# EAGLE design bluz_gw_v1 (EAGLE 7.3.0)
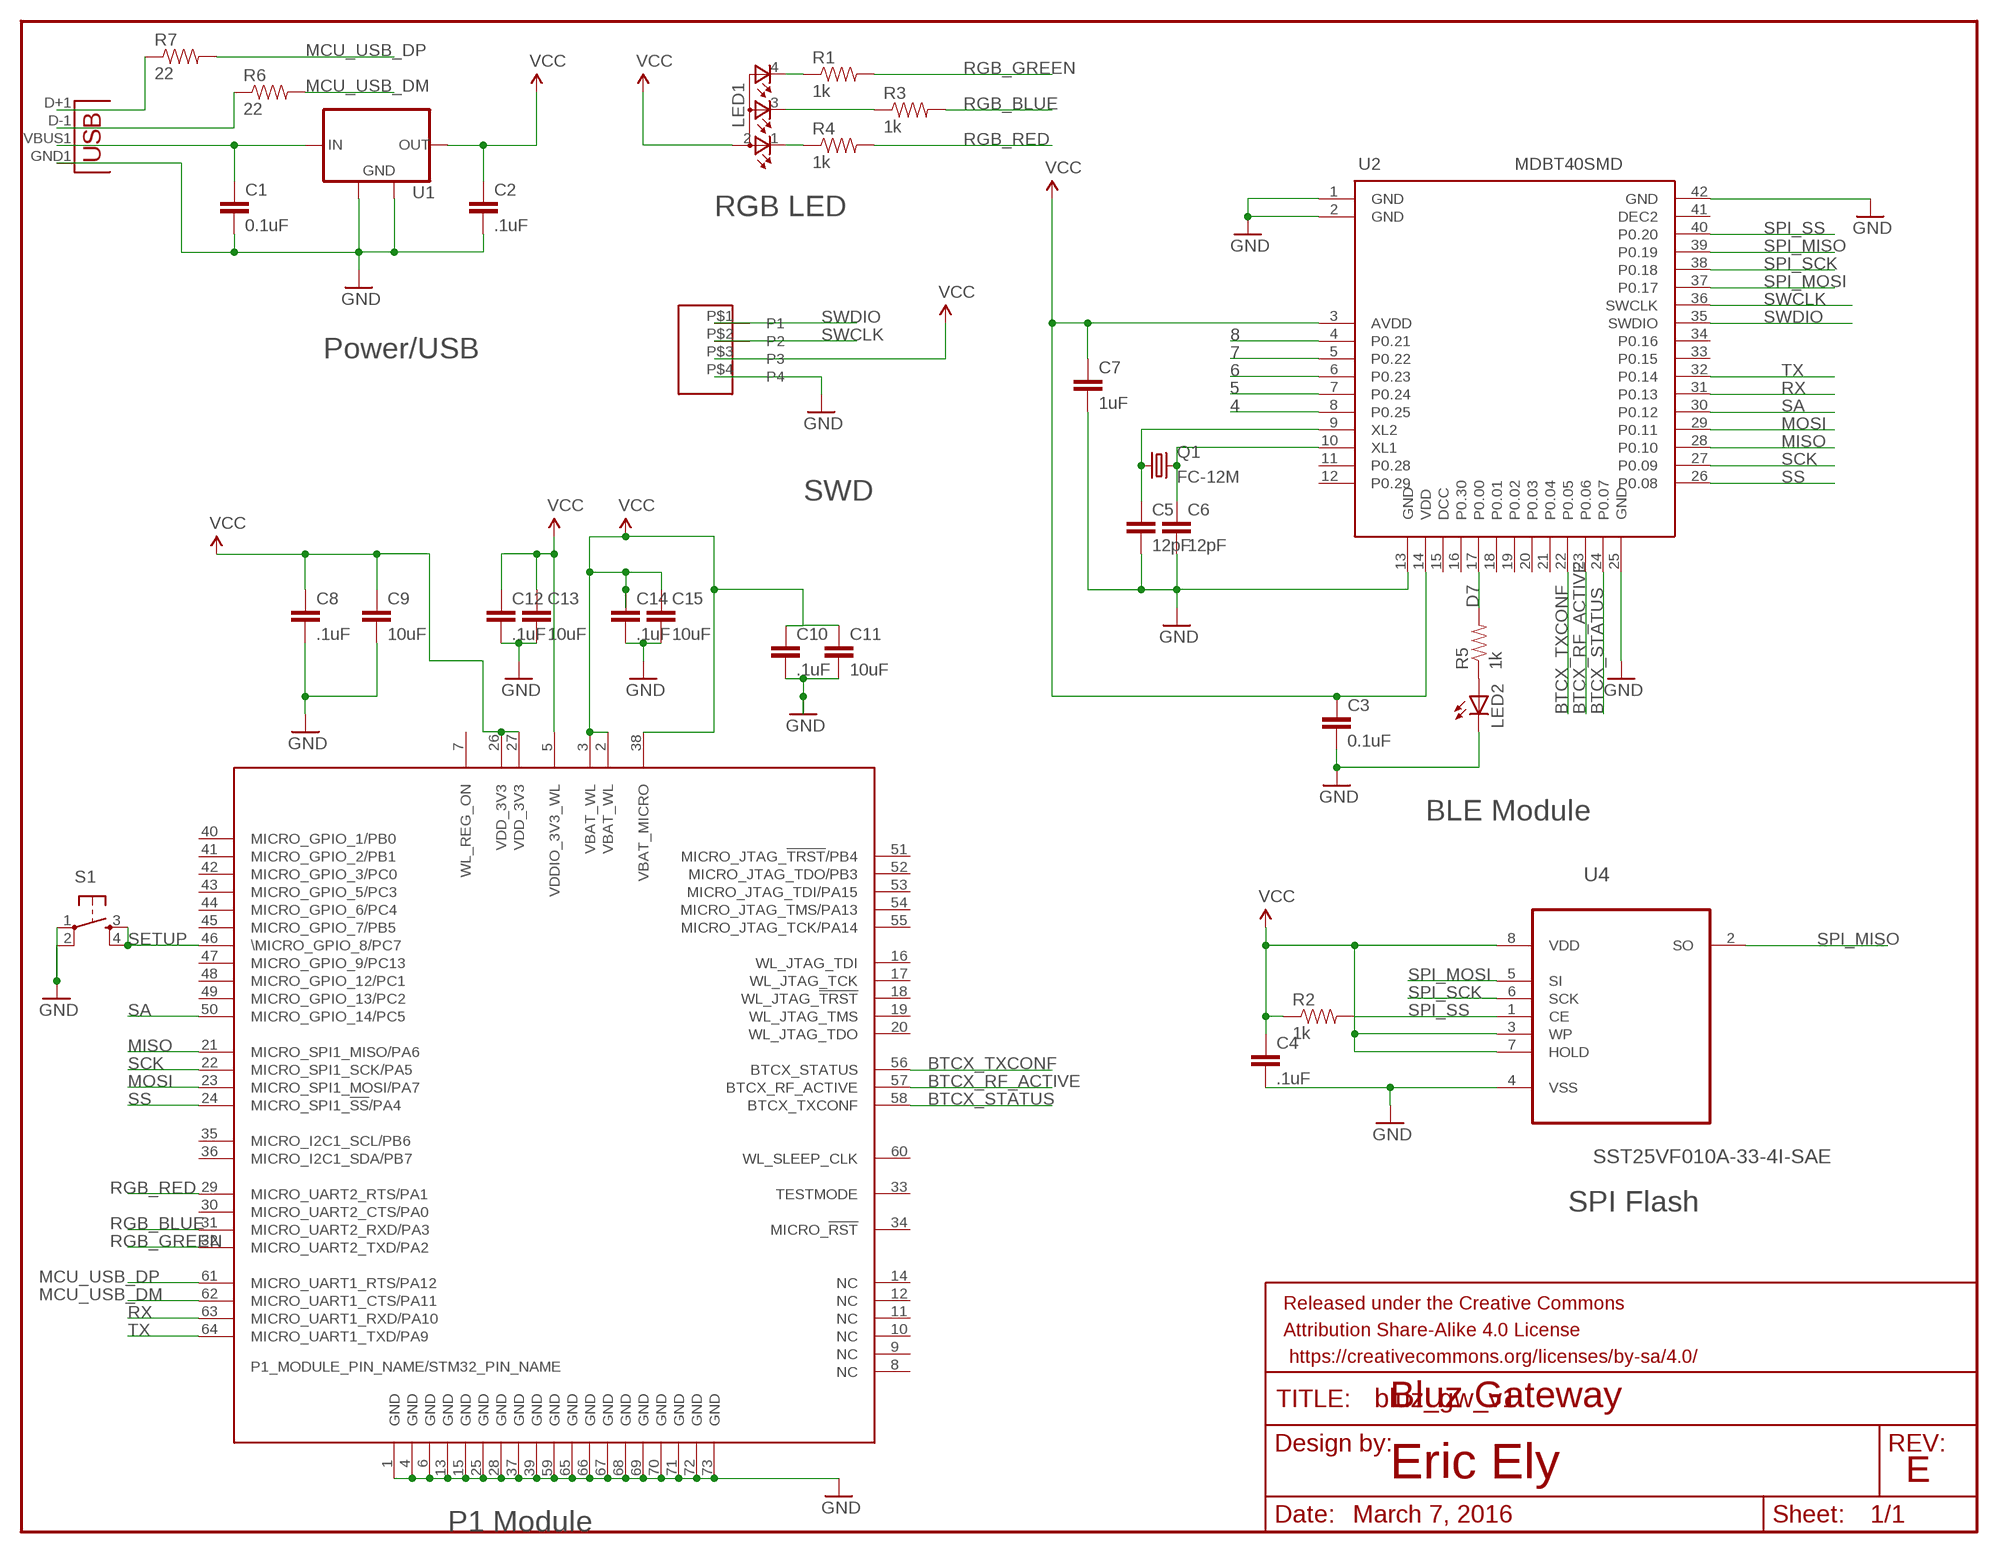
[diagram p0: schematic, sheet 1]

## Parts
C1  0.1uF  CAP0603-CAP  [0603-CAP]
C2  .1uF  CAP0603-CAP  [0603-CAP]
C3  0.1uF  CAP0603-CAP  [0603-CAP]
C4  .1uF  CAP0603-CAP  [0603-CAP]
C5  12pF  CAP0603-CAP  [0603-CAP]
C6  12pF  CAP0603-CAP  [0603-CAP]
C7  1uF  CAP0603-CAP  [0603-CAP]
C8  .1uF  CAP0603-CAP  [0603-CAP]
C9  10uF  CAP0603-CAP  [0603-CAP]
C10  .1uF  CAP0603-CAP  [0603-CAP]
C11  10uF  CAP0603-CAP  [0603-CAP]
C12  .1uF  CAP0603-CAP  [0603-CAP]
C13  10uF  CAP0603-CAP  [0603-CAP]
C14  .1uF  CAP0603-CAP  [0603-CAP]
C15  10uF  CAP0603-CAP  [0603-CAP]
FRAME1  FRAME-LETTER  [CREATIVE_COMMONS]
JP2  USBA-SMD-MALE  [USB-A-SMT-MALE]
LED1  TOPLED-3PLCC  [P-LCC-4-3]
LED2  LEDCHIP-LED0603  [CHIP-LED0603]
Q1  FC-12M  [FC-12M]
R1  1k  RESISTOR0603-RES  [0603-RES]
R2  1k  RESISTOR0603-RES  [0603-RES]
R3  1k  RESISTOR0603-RES  [0603-RES]
R4  1k  RESISTOR0603-RES  [0603-RES]
R5  1k  RESISTOR0603-RES  [0603-RES]
R6  22  RESISTOR0603-RES  [0603-RES]
R7  22  RESISTOR0603-RES  [0603-RES]
S1  TAC_SWITCHSMD  [TACTILE_SWITCH_SMD]
U1  MCP1825S-SOT223  [SOT223]
U2  MDBT40SMD  [MDBT40]
U3  WM-N-BM-14  [WM-N-BM-14]
U4  SST25VF010A-33-4I-SAE  [SOIC127P600X175-8N]
U$3  POGO_CONNECTORPOGO_CONNECTOR  [POGO_CONNECTER]

## Nets
4: U2.8(P0.25)
5: U2.7(P0.24)
6: U2.6(P0.23)
7: U2.5(P0.22)
8: U2.4(P0.21)
BTCX_RF_ACTIVE: U2.23(P0.06) U3.57(BTCX_RF_ACTIVE)
BTCX_STATUS: U2.24(P0.07) U3.58(BTCX_TXCONF)
BTCX_TXCONF: U2.22(P0.05) U3.56(BTCX_STATUS)
D7: R5.2 U2.17(P0.00)
GND: C1.2 C2.2 C3.2 C4.2 C5.2 C6.2 C7.2 C8.2 C9.2 C10.2 C11.2 C12.2 C13.2 C14.2 C15.2 JP2.GND1(GND) LED2.C S1.1 S1.2 U1.2(GND) U1.4(GND) U2.1(GND) U2.2(GND) U2.13(GND) U2.25(GND) U2.42(GND) U3.1(GND) U3.4(GND) U3.6(GND) U3.13(GND) U3.15(GND) U3.25(GND) U3.28(GND) U3.37(GND) U3.39(GND) U3.59(GND) U3.65(GND) U3.66(GND) U3.67(GND) U3.68(GND) U3.69(GND) U3.70(GND) U3.71(GND) U3.72(GND) U3.73(GND) U4.4(VSS) U$3.P$4(P4)
MCU_USB_DM: R6.2 U3.62(MICRO_UART1_CTS/PA11)
MCU_USB_DP: R7.2 U3.61(MICRO_UART1_RTS/PA12)
MISO: U2.28(P0.10) U3.21(MICRO_SPI1_MISO/PA6)
MOSI: U2.29(P0.11) U3.23(MICRO_SPI1_MOSI/PA7)
N$1: C1.1 JP2.VBUS1(VBUS) U1.1(IN)
N$2: LED1.4(CGREEN) R1.1
N$3: LED1.3(CBLUE) R3.1
N$4: LED1.1(CRED) R4.1
N$5: JP2.D-1(D-) R6.1
N$6: JP2.D+1(D+) R7.1
N$7: C5.1 Q1.1 U2.9(XL2)
N$8: C6.1 Q1.2 U2.10(XL1)
N$9: LED2.A R5.1
RGB_BLUE: R3.2 U3.31(MICRO_UART2_RXD/PA3)
RGB_GREEN: R1.2 U3.32(MICRO_UART2_TXD/PA2)
RGB_RED: R4.2 U3.29(MICRO_UART2_RTS/PA1)
RX: U2.31(P0.13) U3.63(MICRO_UART1_RXD/PA10)
SA: U2.30(P0.12) U3.50(MICRO_GPIO_14/PC5)
SCK: U2.27(P0.09) U3.22(MICRO_SPI1_SCK/PA5)
SETUP: S1.3 S1.4 U3.46(\MICRO_GPIO_8/PC7)
SPI_MISO: U2.39(P0.19) U4.2(SO)
SPI_MOSI: U2.37(P0.17) U4.5(SI)
SPI_SCK: U2.38(P0.18) U4.6(SCK)
SPI_SS: R2.2 U2.40(P0.20) U4.1(CE)
SS: U2.26(P0.08) U3.24(MICRO_SPI1_!SS!/PA4)
SWCLK: U2.36(SWCLK) U$3.P$2(P2)
SWDIO: U2.35(SWDIO) U$3.P$1(P1)
TX: U2.32(P0.14) U3.64(MICRO_UART1_TXD/PA9)
VCC: C2.1 C3.1 C4.1 C7.1 C8.1 C9.1 C10.1 C11.1 C12.1 C13.1 C14.1 C15.1 LED1.2(A2) R2.1 U1.3(OUT) U2.3(AVDD) U2.14(VDD) U3.2(VBAT_WL) U3.3(VBAT_WL) U3.5(VDDIO_3V3_WL) U3.26(VDD_3V3) U3.27(VDD_3V3) U3.38(VBAT_MICRO) U4.3(WP) U4.7(HOLD) U4.8(VDD) U$3.P$3(P3)
Unconnected: U2.11(P0.28) U2.12(P0.29) U2.15(DCC) U2.16(P0.30) U2.18(P0.01) U2.19(P0.02) U2.20(P0.03) U2.21(P0.04) U2.33(P0.15) U2.34(P0.16) U2.41(DEC2) U3.7(WL_REG_ON) U3.8(NC) U3.9(NC) U3.10(NC) U3.11(NC) U3.12(NC) U3.14(NC) U3.16(WL_JTAG_TDI) U3.17(WL_JTAG_TCK) U3.18(WL_JTAG_!TRST!) U3.19(WL_JTAG_TMS) U3.20(WL_JTAG_TDO) U3.30(MICRO_UART2_CTS/PA0) U3.33(TESTMODE) U3.34(MICRO_!RST!) U3.35(MICRO_I2C1_SCL/PB6) U3.36(MICRO_I2C1_SDA/PB7) U3.40(MICRO_GPIO_1/PB0) U3.41(MICRO_GPIO_2/PB1) U3.42(MICRO_GPIO_3/PC0) U3.43(MICRO_GPIO_5/PC3) U3.44(MICRO_GPIO_6/PC4) U3.45(MICRO_GPIO_7/PB5) U3.47(MICRO_GPIO_9/PC13) U3.48(MICRO_GPIO_12/PC1) U3.49(MICRO_GPIO_13/PC2) U3.51(MICRO_JTAG_!TRST!/PB4) U3.52(MICRO_JTAG_TDO/PB3) U3.53(MICRO_JTAG_TDI/PA15) U3.54(MICRO_JTAG_TMS/PA13) U3.55(MICRO_JTAG_TCK/PA14) U3.60(WL_SLEEP_CLK)

## Notes on the sheet
- RGB LED
- Power/USB
- SWD
- BLE Module
- SPI Flash
- Bluz Gateway
- Eric Ely | E
- March 7, 2016
- P1 Module

## Library data of the parts
C1 C5 C6 = SparkFun-Passives:CAP: Capacitor Standard 0603 ceramic capacitor, and 0.1" leaded capacitor.
C2-C4 C7-C15 = SparkFun-Capacitors:CAP: Capacitor Standard 0603 ceramic capacitor, and 0.1" leaded capacitor.
FRAME1 = SparkFun-Aesthetics:FRAME-LETTER: Schematic Frame Standard 8.5x11 US Letter frame
JP2 = Spark2:USB
LED1 = bluze_libr:TOPLED-3: Cree CLVBA-FKA
LED2 = led:LED: LED OSRAM: - CHIPLED LG R971, LG N971, LY N971, LG Q971, LY Q971, LO R971, LY R971 LH N974, LH R974 LS Q976, LO Q976, LY Q976 LO Q996 - Hyper CHIPLED LW Q18S LB Q993, LB Q99A, LB R99A - SideLED LS A670, LO A670, LY A670, LG A670, LP A670 LB A673, LV A673, LT A673, LW A673 LH A674 LY A675 LS A676, LA A676, LO A676, LY A676, LW A676 LS A679, LY A679, LG A679 - Hyper Micro SIDELED® LS Y876, LA Y876, LO Y876, LY Y876 LT Y87S - SmartLED LW L88C, LW L88S LB L89C, LB L89S, LG L890 LS L89K, LO L89K, LY L89K LS L896, LA L896, LO L896, LY L896 - TOPLED LS T670, LO T670, LY T670, LG T670, LP T670 LSG T670, LSP T670, LSY T670, LOP T670, LYG T670 LG T671, LOG T671, LSG T671 LB T673, LV T673, LT T673, LW T673 LH T674 LS T676, LA T676, LO T676, LY T676, LB T676, LH T676, LSB T676, LW T676 LB T67C, LV T67C, LT T67C, LS T67K, LO T67K, LY T67K, LW E67C LS E67B, LA E67B, LO E67B, LY E67B, LB E67C, LV E67C, LT E67C LW T67C LS T679, LY T679, LG T679 LS T770, LO T770, LY T770, LG T770, LP T770 LB T773, LV T773, LT T773, LW T773 LH T774 LS E675, LA E675, LY E675, LS T675 LS T776, LA T776, LO T776, LY T776, LB T776 LHGB T686 LT T68C, LB T68C - Hyper Mini TOPLED® LB M676 - Mini TOPLED Santana® LG M470 LS M47K, LO M47K, LY M47K Source: http://www.osram.convergy.de LUXEON: - LUMILED® LXK2-PW12-R00, LXK2-PW12-S00, LXK2-PW14-U00, LXK2-PW14-V00 LXK2-PM12-R00, LXK2-PM12-S00, LXK2-PM14-U00 LXK2-PE12-Q00, LXK2-PE12-R00, LXK2-PE12-S00, LXK2-PE14-T00, LXK2-PE14-U00 LXK2-PB12-K00, LXK2-PB12-L00, LXK2-PB12-M00, LXK2-PB14-N00, LXK2-PB14-P00, LXK2-PB14-Q00 LXK2-PR12-L00, LXK2-PR12-M00, LXK2-PR14-Q00, LXK2-PR14-R00 LXK2-PD12-Q00, LXK2-PD12-R00, LXK2-PD12-S00 LXK2-PH12-R00, LXK2-PH12-S00 LXK2-PL12-P00, LXK2-PL12-Q00, LXK2-PL12-R00 Source: www.luxeon.com KINGBRIGHT: KA-3528ASYC Source: www.kingbright.com
Q1 = crystal:FC-12M: kHz RANGE CRYSTAL UNIT LOW PROFILE SMD Source: Epson Toyocom FC-12M.pdf
R1-R7 = SparkFun-Passives:RESISTOR: Resistor Basic schematic elements and footprints for 0603, 1206, and PTH resistors.
S1 = Spark:TAC_SWITCH: SMD Tactiile Switch
U1 = Spark:MCP1825S: 500 mA, Low Voltage, Low Quiescent Current LDO Regulator
U2 = MDBT40:MDBT40
U3 = Spark2:WM-N-BM-14
U4 = Silicon_Storage_Tech_By_element14_Batch_1:SST25VF010A-33-4I-SAE: 1 Mbit SPI Serial Flash; MPN: SST25VF010A-33-4I-SAE; OC_FARNELL: 1368686; OC_NEWARK: 54M1121; PACKAGE: SOIC-8; SUPPLIER: SILICON STORAGE TECHNOLOGY
U$3 = bluze_libr:POGO_CONNECTOR

## Board
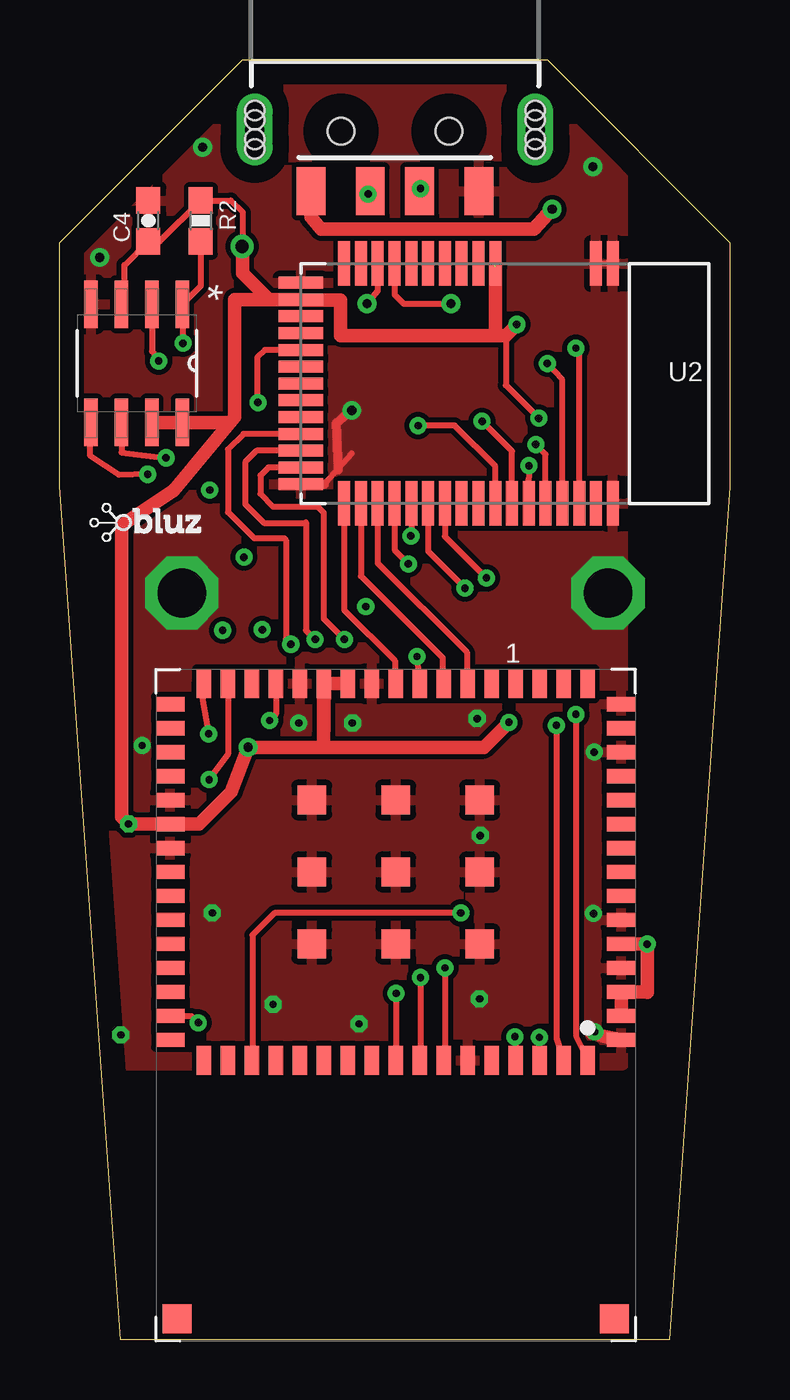
[diagram p1: board, top side]
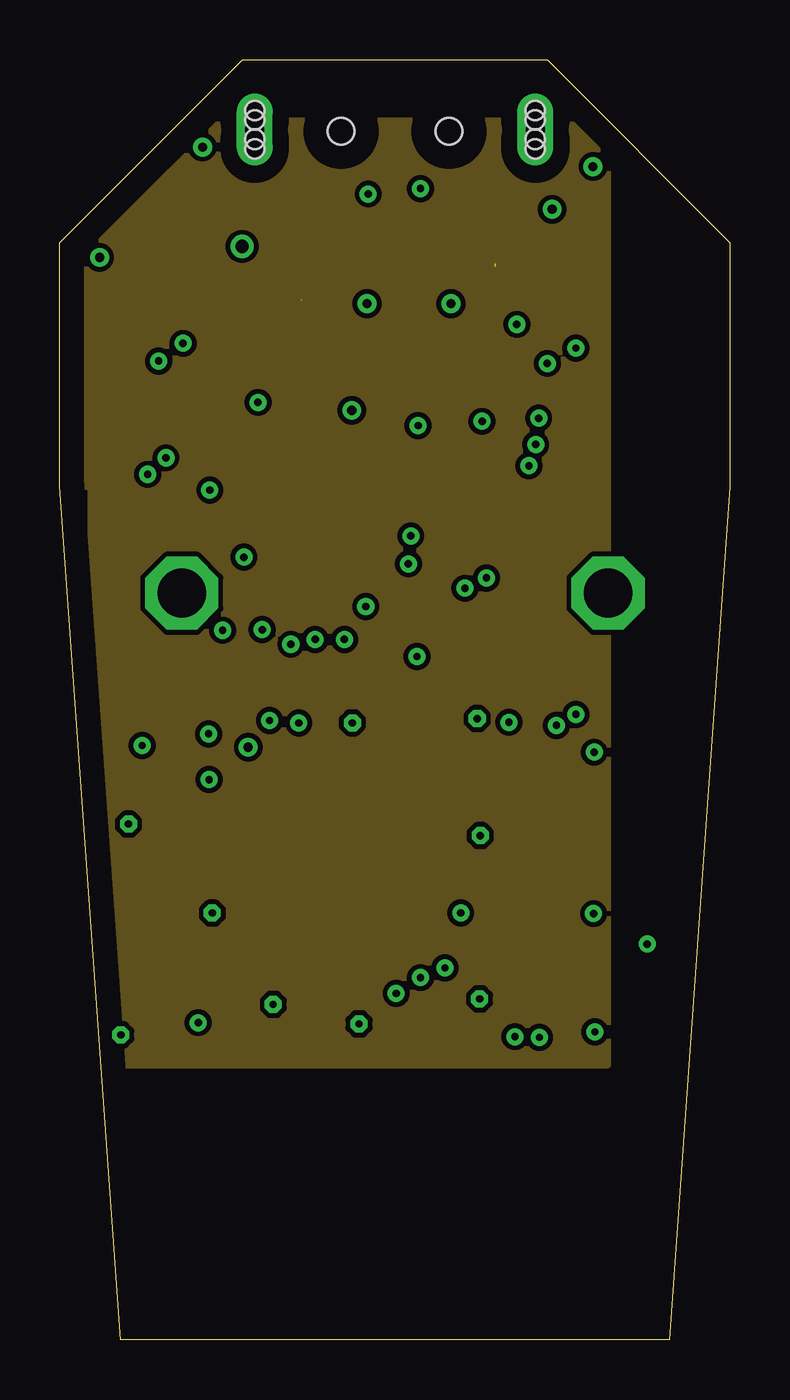
[diagram p2: board, inner layer GND]
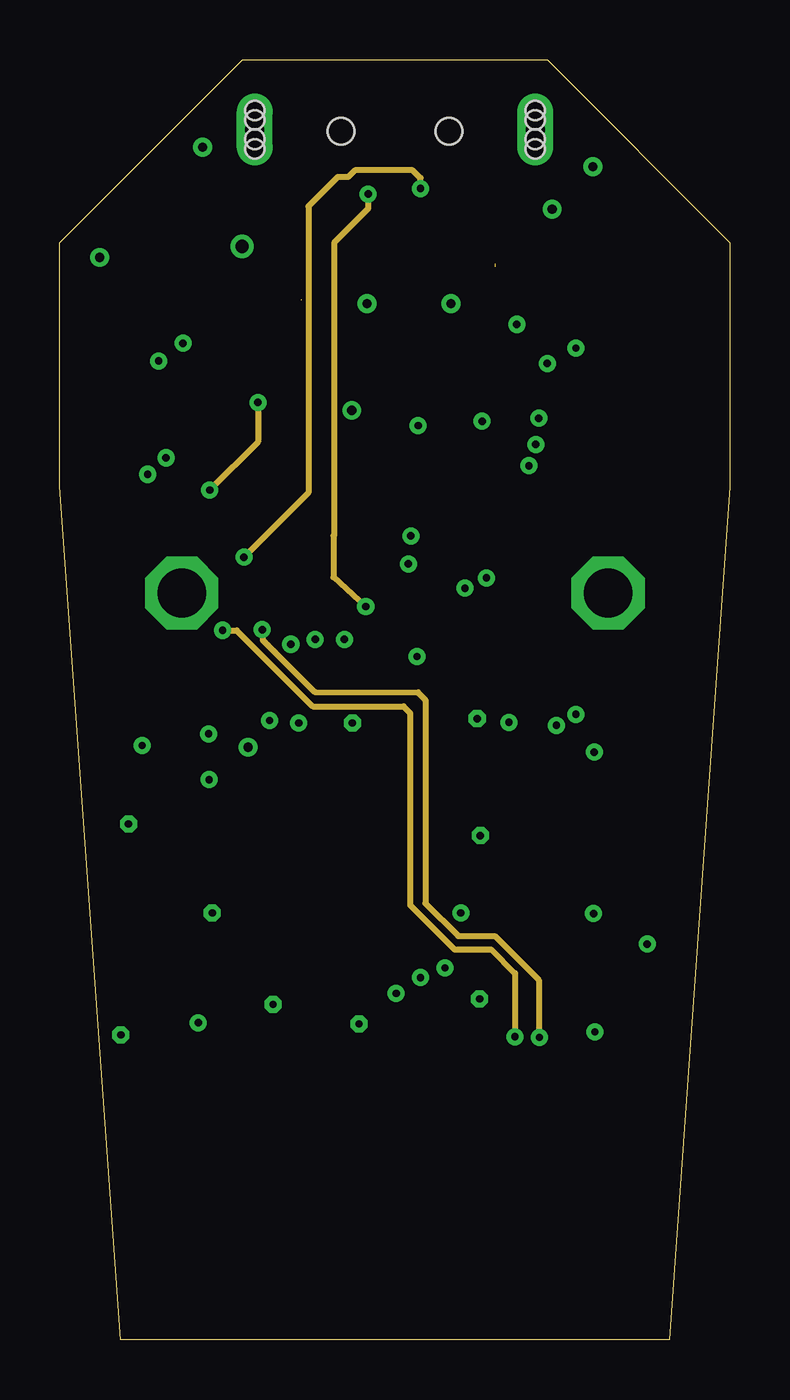
[diagram p3: board, inner layer Middle]
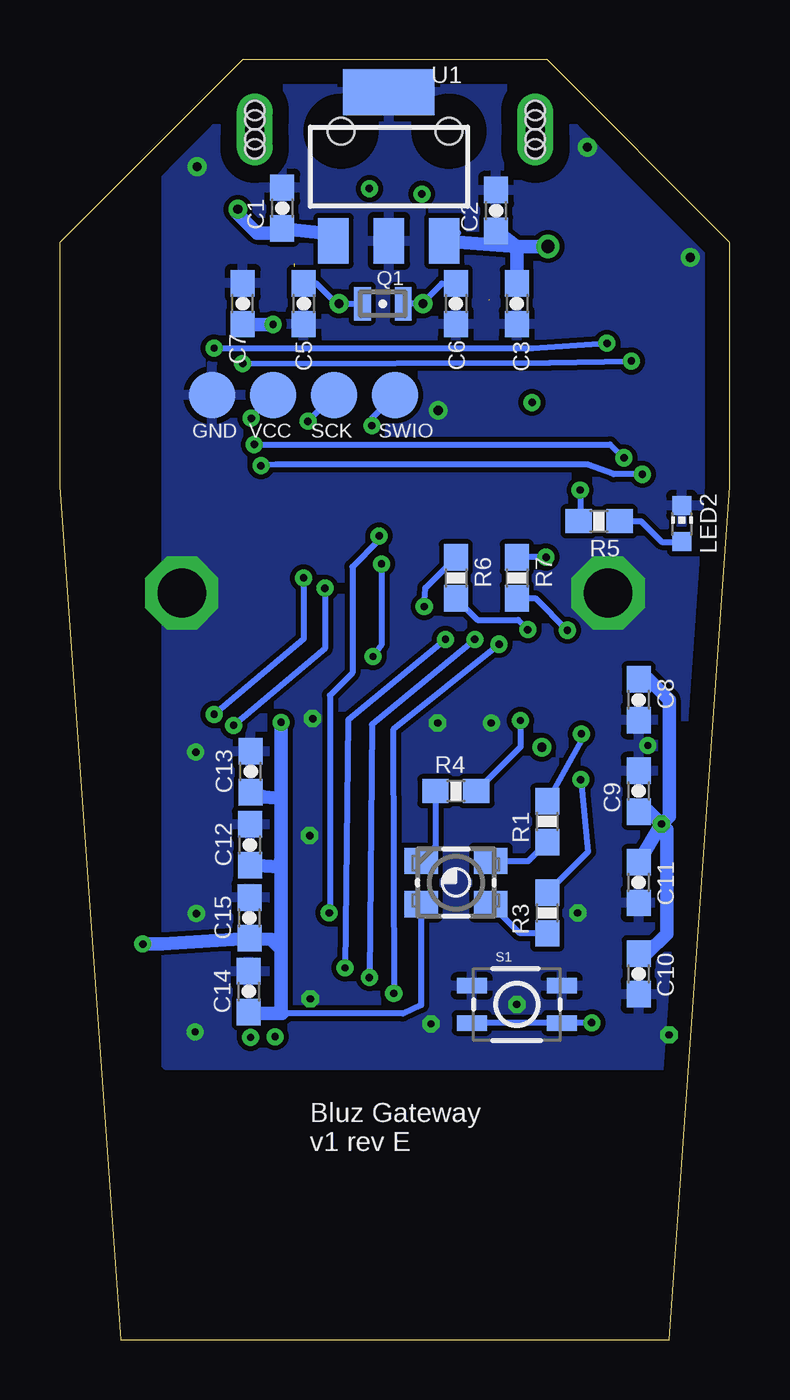
[diagram p4: board, bottom side, seen from below]

Size 27.94 x 53.34 mm. Coordinates in mm from the lower left corner, seen from the top.
Outline: 2.54,0 0,35.56 0,45.72 7.62,53.34 20.32,53.34 27.94,45.72 27.94,35.56 25.4,0 2.54,0
Copper layers (1*16): Top 0.035mm / dielectric 1.5mm / Bottom 0.035mm
Design rules "default *": minimum track width 10mil, minimum drill 24mil, track to track 8mil, track to pad 8mil, pad to pad 8mil, via to via 8mil, smd to smd 8mil, copper to edge 40mil, drill to drill 8mil, minimum pad ring 10mil, minimum via ring 8mil, stop-mask expansion 4mil, vias tented up to drill 25mil, thermal gap 10mil

### Footprints (pad centres in the part's own frame; a part is rotated, then mirrored left to right if it is on the bottom)
0603-CAP = smd 1.1 x 1: 1 -0.85,0; 2 0.85,0
USB-A-SMT-MALE = smd 1.2 x 2: D+1 1.027,-3.67; D-1 -1.027,-3.67; GND1 3.5,-3.67; VBUS1 -3.5,-3.67 | drill 0.8 pad 1.5 long: P$1 5.85,-1.1; P$3 -5.85,-1.1 | hole 1.1: 2.25,-1.17; -2.25,-1.17 | hole 0.8: -5.85,-1.5; -5.85,-1.9; -5.85,-0.7; -5.85,-0.3; 5.85,-1.5; 5.85,-1.9; 5.85,-0.7; 5.85,-0.3
P-LCC-4-3 = smd 1.1 x 1.4: 1 0.9,1.45; 2 -0.9,1.45; 3 -0.9,-1.45; 4 0.9,-1.45
CHIP-LED0603 = smd 0.8 x 0.8: A 0,-0.75; C 0,0.75
FC-12M = smd 0.7 x 1.4: 1 -0.85,0; 2 0.85,0
0603-RES = smd 1.1 x 1: 1 -0.85,0; 2 0.85,0
TACTILE_SWITCH_SMD = smd 1.25 x 0.65: 1 -1.875,0.775; 2 1.875,0.775; 3 -1.875,-0.775; 4 1.875,-0.775
SOT223 = smd 1.27 x 1.905: 1 -2.311,-3.099; 2 0,-3.099; 3 2.311,-3.099 | smd 3.81 x 1.905: 4 0,3.099
MDBT40 = smd 1.85 x 0.5: 1 -5,4; 2 -5,3.3; 3 -5,-0.9; 4 -5,-1.6; 5 -5,-2.3; 6 -5,-3; 7 -5,-3.7; 8 -5,-4.4; 9 -5,-5.1; 10 -5,-5.8; 11 -5,-6.5; 12 -5,-7.2; 26 5,-7.2; 27 5,-6.5; 28 5,-5.8; 29 5,-5.1; 30 5,-4.4; 31 5,-3.7; 32 5,-3; 33 5,-2.3; 34 5,-1.6; 35 5,-0.9; 36 5,-0.2; 37 5,0.5; 38 5,1.2; 39 5,1.9; 40 5,2.6; 41 5,3.3; 42 5,4 | smd 0.5 x 1.85: 13 -4.2,-9; 14 -3.5,-9; 15 -2.8,-9; 16 -2.1,-9; 17 -1.4,-9; 18 -0.7,-9; 19 0,-9; 20 0.7,-9; 21 1.4,-9; 22 2.1,-9; 23 2.8,-9; 24 3.5,-9; 25 4.2,-9
WM-N-BM-14 = smd 1.2 x 0.6: 1 0.6,15.45; 2 0.6,14.45; 3 0.6,13.45; 4 0.6,12.45; 5 0.6,11.45; 6 0.6,10.45; 7 0.6,9.45; 8 0.6,8.45; 9 0.6,7.45; 10 0.6,6.45; 11 0.6,5.45; 12 0.6,4.45; 13 0.6,3.45; 14 0.6,2.45; 15 0.6,1.45; 33 19.4,1.45; 34 19.4,2.45; 35 19.4,3.45; 36 19.4,4.45; 37 19.4,5.45; 38 19.4,6.45; 39 19.4,7.45; 40 19.4,8.45; 41 19.4,9.45; 42 19.4,10.45; 43 19.4,11.45; 44 19.4,12.45; 45 19.4,13.45; 46 19.4,14.45; 47 19.4,15.45 | smd 0.6 x 1.2: 16 2,0.6; 17 3,0.6; 18 4,0.6; 19 5,0.6; 20 6,0.6; 21 7,0.6; 22 8,0.6; 23 9,0.6; 24 10,0.6; 25 11,0.6; 26 12,0.6; 27 13,0.6; 28 14,0.6; 29 15,0.6; 30 16,0.6; 31 17,0.6; 32 18,0.6; 48 18,16.3; 49 17,16.3; 50 16,16.3; 51 15,16.3; 52 14,16.3; 53 13,16.3; 54 12,16.3; 55 11,16.3; 56 10,16.3; 57 9,16.3; 58 8,16.3; 59 7,16.3; 60 6,16.3; 61 5,16.3; 62 4,16.3; 63 3,16.3; 64 2,16.3 | smd 1.2 x 1.2: 65 6.5,11.45; 66 6.5,8.45; 67 6.5,5.45; 68 10,11.45; 69 10,8.45; 70 10,5.45; 71 13.5,11.45; 72 13.5,8.45; 73 13.5,5.45; 74 19.12,27.07; 75 0.88,27.07
SOIC127P600X175-8N = smd 1.981 x 0.559: 1 -2.464,1.905; 2 -2.464,0.635; 3 -2.464,-0.635; 4 -2.464,-1.905; 5 2.464,-1.905; 6 2.464,-0.635; 7 2.464,0.635; 8 2.464,1.905
POGO_CONNECTER = smd 1.93 x 1.93: P$1 1.27,2.54; P$2 3.81,2.54; P$3 6.35,2.54; P$4 8.89,2.54

### Placement (x,y rotation side)
C1  18.67,47.17 90 bottom
C2  9.75,47.07 90 bottom
C3  8.89,43.18 270 bottom
C4  3.68,46.63 90 top
C5  17.78,43.18 270 bottom
C6  11.43,43.18 270 bottom
C7  20.32,43.18 90 bottom
C8  3.81,26.67 270 bottom
C9  3.81,22.86 90 bottom
C10  3.81,15.24 270 bottom
C11  3.81,19.05 270 bottom
C12  20.02,20.62 90 bottom
C13  19.99,23.67 90 bottom
C14  20.07,14.5 90 bottom
C15  20.04,17.58 90 bottom
FRAME1  67.31,29.21 0 top  (outside the outline)
JP2  13.97,51.54 0 top
LED1  11.43,19.05 90 bottom
LED2  2.01,34.01 0 bottom
Q1  14.48,43.18 0 bottom
R1  7.62,21.59 90 bottom
R2  5.87,46.63 270 top
R3  7.62,17.78 90 bottom
R4  11.43,22.86 0 bottom
R5  5.46,34.11 180 bottom
R6  11.43,31.75 270 bottom
R7  8.89,31.75 270 bottom
S1  8.89,13.97 0 bottom
U1  14.22,48.9 0 bottom
U2  19.05,39.85 270 top
U3  24,27.94 180 top
U4  3.2,40.69 270 top
U$2  [BLUZE_LOGO_LOW_RES]  1.24,33.27 0 top
U$3  12.7,41.91 180 bottom

### Tracks (layer width: path | path; a pad name or v marks a point on that pad's centre or on a via)
BTCX_RF_ACTIVE  (via drill 0.3)
  Top 0.254: U2.23 8.2,37.05 7.72,36.58 7.72,34.82 8.51,34.04 10.24,34.04 10.26,34.06 10.26,29.57 v10.64,29.18 | v15.04,15.09 15.04,11.67 U3.57
  Bottom 0.254: v10.64,29.18 14.94,25.63 v15.04,15.09
BTCX_STATUS  (via drill 0.3)
  Top 0.254: U2.24 8.69,36.35 8.36,36.02 8.36,35.26 8.89,34.72 10.74,34.72 11,34.47 11,30.05 v11.86,29.18 | v16.05,15.49 16.05,11.69 U3.58
  Bottom 0.254: v11.86,29.18 15.93,25.83 v16.05,15.49
BTCX_TXCONF  (via drill 0.3)
  Top 0.254: U2.22 7.65,37.75 7.01,37.11 7.01,34.49 8.1,33.4 9.35,33.4 9.42,33.33 9.42,29.18 v9.63,28.98 | v14.02,14.43 14.02,11.66 U3.56
  Bottom 0.254: v9.63,28.98 14.05,25.43 v14.02,14.43
D7  (via drill 0.3)
  Top 0.254: U2.17 8.54,41.25 8.23,40.95 8.23,39.09 v8.26,39.06
  Middle 0.254: v8.26,39.06 8.26,37.41 v6.25,35.41
  Bottom 0.254: v6.25,35.41 6.25,34.17 R5.2
GND  (via drill 0.3, 0.38, 2.03)
  Top 0.254: U2.1 U2.2 | 11.02,35.65 11.06,35.73 12.17,36.93
  Top 0.381: U2.25 11.02,35.65 | 11.61,36.25 11.53,38.2 v12.17,38.73
  Top 0.559: U3.1 22.69,12.64 22.17,12.78
  other vias: 5.08,31.11 22.86,31.11 5.94,49.71 22.23,48.9 9.96,25.7 22.25,17.75 22.28,24.49 22.3,12.83 3.43,24.77 12.19,25.7 17.4,25.88 17.53,21.01 17.5,14.2 6.35,17.78 2.54,12.7 8.89,13.97 12.47,13.16 1.65,45.11
  pour Top: -1.27,53.34 0,11.43 23.5,11.43 23.5,53.34
  pour Bottom: -1.27,53.34 0,11.43 23.5,11.43 23.5,53.34
MCU_USB_DM  (via drill 0.3)
  Top 0.254: v19.99,12.6 20.02,11.63 U3.62
  Middle 0.254: v8.43,29.59 8.46,29.16 10.62,27 14.94,26.98 15.24,26.67 15.24,18.19 16.61,16.82 18.14,16.82 19.96,14.99 19.96,12.52 v19.99,12.6
  Bottom 0.254: R6.2 11.43,30.89 10.54,30 8.84,30 v8.43,29.59
MCU_USB_DP  (via drill 0.3)
  Top 0.254: v18.97,12.62 19,12.13 U3.61
  Middle 0.254: v6.78,29.57 7.37,29.57 10.54,26.39 14.33,26.39 14.61,26.11 14.61,18.11 16.46,16.26 17.98,16.26 18.97,15.27 v18.97,12.62 19,12.62
  Bottom 0.254: R7.2 8.12,30.9 v6.78,29.57
MISO
  Top 0.254: U2.28 13.25,32.37 16.97,28.65 16.97,27.38 U3.21
MOSI  (via drill 0.3)
  Top 0.254: U2.29 13.95,32.91 v14.53,32.33 | v14.88,28.47 14.96,27.38 U3.23
  Bottom 0.254: v14.53,32.33 14.53,28.98 v14.88,28.47
N$1  (via drill 0.38)
  Top 0.559: JP2.VBUS1 10.47,46.78 10.9,46.28 19.76,46.28 v20.52,47.12
  Bottom 0.559: v20.52,47.12 20.52,46.94 19.71,46.13 19.06,46.13 C1.1 17.11,46.14 U1.1
N$2
  Bottom 0.254: LED1.4 8.41,19.95 R1.1
N$3
  Bottom 0.254: R3.1 8.76,16.93 LED1.3
N$4
  Bottom 0.254: R4.1 12.28,20.55 LED1.1
N$5  (via drill 0.3)
  Top 0.254: JP2.D-1 12.94,47.84 v12.85,47.75
  Middle 0.254: v12.85,47.75 12.85,47.14 11.43,45.72 11.43,33.53 11.4,33.5 11.4,31.77 v12.75,30.56
  Bottom 0.254: v12.75,30.56 12.7,31.33 R6.1
N$6  (via drill 0.3)
  Top 0.254: JP2.D+1 15,47.94 v15.04,47.98
  Middle 0.254: v15.04,47.98 15.04,48.41 14.71,48.74 12.29,48.74 12.01,48.46 11.58,48.46 10.36,47.24 10.36,35.31 v7.67,32.61
  Bottom 0.254: v7.67,32.61 8.88,32.61 R7.1
N$7  (via drill 0.38)
  Top 0.254: U2.9 13.95,43.56 14.33,43.18 v16.31,43.18
  Bottom 0.254: Q1.1 v16.31,43.18 16.41,43.18 17.25,44.02 17.77,44.02 C5.1
N$8  (via drill 0.38)
  Top 0.254: U2.10 13.25,43.7 v12.8,43.18
  Bottom 0.254: Q1.2 v12.8,43.18 12.72,43.31 12.01,44.02 11.44,44.02 C6.1
N$9
  Bottom 0.254: R5.1 3.71,34.11 2.85,33.25 LED2.A
N$10
  pour GND: 1.27,11.43 22.86,11.43 22.86,50.8 6.35,50.8 5.08,50.8 0,45.72 0,35.56 1.27,35.56
RGB_BLUE  (via drill 0.3)
  Top 0.254: U3.31 7,24.4 v6.22,23.34
  Bottom 0.254: v6.22,23.34 5.92,20.33 R3.2
RGB_GREEN  (via drill 0.3)
  Top 0.254: U3.32 5.82,27.34 v6.2,25.25
  Bottom 0.254: v6.2,25.25 6.2,24.98 R1.2
RGB_RED  (via drill 0.3)
  Top 0.254: U3.29 9,26.07 v8.74,25.81
  Bottom 0.254: v8.74,25.81 8.74,24.7 R4.2
RX  (via drill 0.3)
  Top 0.254: U2.31 15.35,32.86 v16.89,31.32 | v20.7,25.6 20.7,12.55 U3.63
  Bottom 0.254: v16.89,31.32 16.89,28.8 v20.7,25.6
SA  (via drill 0.3)
  Top 0.254: U2.30 14.65,33.52 v14.63,33.5 | v16.71,17.78 8.94,17.78 8.03,16.87 8.03,11.66 U3.50
  Bottom 0.254: v14.63,33.5 14.63,33.33 15.75,32.21 15.75,27.79 16.69,26.85 16.69,17.8 v16.71,17.78
SCK
  Top 0.254: U2.27 12.55,31.82 15.95,28.42 15.95,27.39 U3.22
SETUP  (via drill 0.3)
  Top 0.254: U3.46 5.48,13.49 v5.77,13.21
  Bottom 0.254: v5.77,13.21 7,13.21 S1.4 S1.3
SPI_MISO  (via drill 0.3)
  Top 0.254: U2.39 20.95,40.01 v20.32,40.69 | U4.2 3.83,41.2 v4.12,40.79
  Bottom 0.254: v20.32,40.69 7.52,40.72 v4.12,40.79
SPI_MOSI  (via drill 0.3)
  Top 0.254: v19.56,36.42 19.58,36.25 19.53,35.81 19.53,34.87 U2.37 | v3.66,36.07 2.46,36.04 1.27,36.83 1.27,38.2 U4.5
  Bottom 0.254: v3.66,36.07 4.85,36.07 5.94,36.47 18.95,36.47 v19.56,36.42
SPI_SCK  (via drill 0.3)
  Top 0.254: U2.38 20.25,36.9 v19.84,37.31 | U4.6 2.56,36.98 v4.42,36.75
  Bottom 0.254: v19.84,37.31 5,37.31 v4.42,36.75
SPI_SS  (via drill 0.3)
  Top 0.254: U2.40 21.65,41.19 v21.51,41.33 | v5.13,41.53 5.13,43.13 U4.1 5.87,43.92 R2.2
  Bottom 0.254: v21.51,41.33 8.23,41.33 v5.13,41.53
SS
  Top 0.254: U2.26 11.85,30.42 13.97,28.3 13.97,27.37 U3.24
SWCLK  (via drill 0.3)
  Top 0.254: U2.36 18.85,37.03 v17.6,38.28
  Bottom 0.254: v17.6,38.28 U$3.P$2
SWDIO  (via drill 0.3)
  Top 0.254: U2.35 18.15,36.41 16.46,38.1 v14.94,38.1
  Bottom 0.254: v14.94,38.1 14.94,38.41 U$3.P$1
TX  (via drill 0.3)
  Top 0.254: U2.32 16.05,33.48 v17.78,31.75 | v21.51,26.06 21.51,12.66 U3.64
  Bottom 0.254: v17.78,31.75 17.78,29.21 v21.51,26.06
VCC  (via drill 0.3, 0.38, 0.56)  (2 unrouted)
  Top 0.254: 18.59,41.86 18.59,39.78 v19.96,38.41 | 7.07,38.23 7.29,38.45 | U4.3 2.69,43.28 2.69,44.79 C4.1 4.17,45.78 R2.1 7.13,47.48 7.62,46.99 7.62,45.59 v7.59,45.57
  Top 0.559: U2.14 8.72,43.35 | 8.72,43.35 7.29,43.35 7.29,38.45 4.75,35.38 2.56,33.96 2.56,21.79 v2.86,21.49 U3.38 5.79,21.49 7.14,22.84 v7.85,24.69 11,24.69 | 8.72,43.35 7.62,44.45 7.62,45.54 v7.59,45.57 | 11,24.69 11.02,27.32 U3.27 U3.26 11.08,27.34 11,27.25 11,24.69 | U3.5 v24.49,16.48 24.49,14.48 24.37,14.49 U3.3 U3.2 | 10.06,43.33 11.71,43.33 11.71,41.86 18.16,41.86 | 18.16,41.86 18.16,44.73 | 18.16,41.86 18.59,41.86 v19.05,42.32 | U4.7 U4.8 7.07,38.23 | 11,24.69 17.68,24.69 v18.72,25.73
  Bottom 0.254: 11.34,46.14 U1.3 | v19.96,38.41 19.96,38.46 U$3.P$3 | LED1.2 12.88,13.94 13.64,13.59 18.67,13.59 18.69,13.59 | C8.1 3.39,27.52
  Bottom 0.559: U1.3 8.89,45.57 | 8.89,45.57 v7.59,45.57 | C2.1 8.89,45.57 | C3.1 8.89,45.57 | v18.72,25.73 18.72,22.55 | 18.72,22.55 18.72,20.02 | 18.72,20.02 18.72,16.26 | 18.72,16.26 18.72,13.74 | 18.69,13.59 18.72,13.74 | 18.72,13.74 18.67,13.59 20.05,13.59 C14.1 | 18.72,16.26 19.14,16.68 C15.1 23.69,16.5 v24.49,16.48 | C12.1 18.81,19.7 18.72,20.02 | C13.1 19.42,22.62 18.72,22.55 | v2.86,21.49 C11.1 | v19.05,42.32 20.31,42.32 C7.1 | 3.39,27.52 2.54,26.67 2.54,21.81 v2.86,21.49 | C9.1 3.38,22.01 v2.86,21.49 | C10.1 3.47,16.09 2.64,16.92 2.64,21.27 v2.86,21.49

### Text on the board
tNames: 1
bNames: SWIO | SCK | VCC | GND | Bluz Gateway / v1 rev E